# EAGLE design schematics (EAGLE 7.6.0)
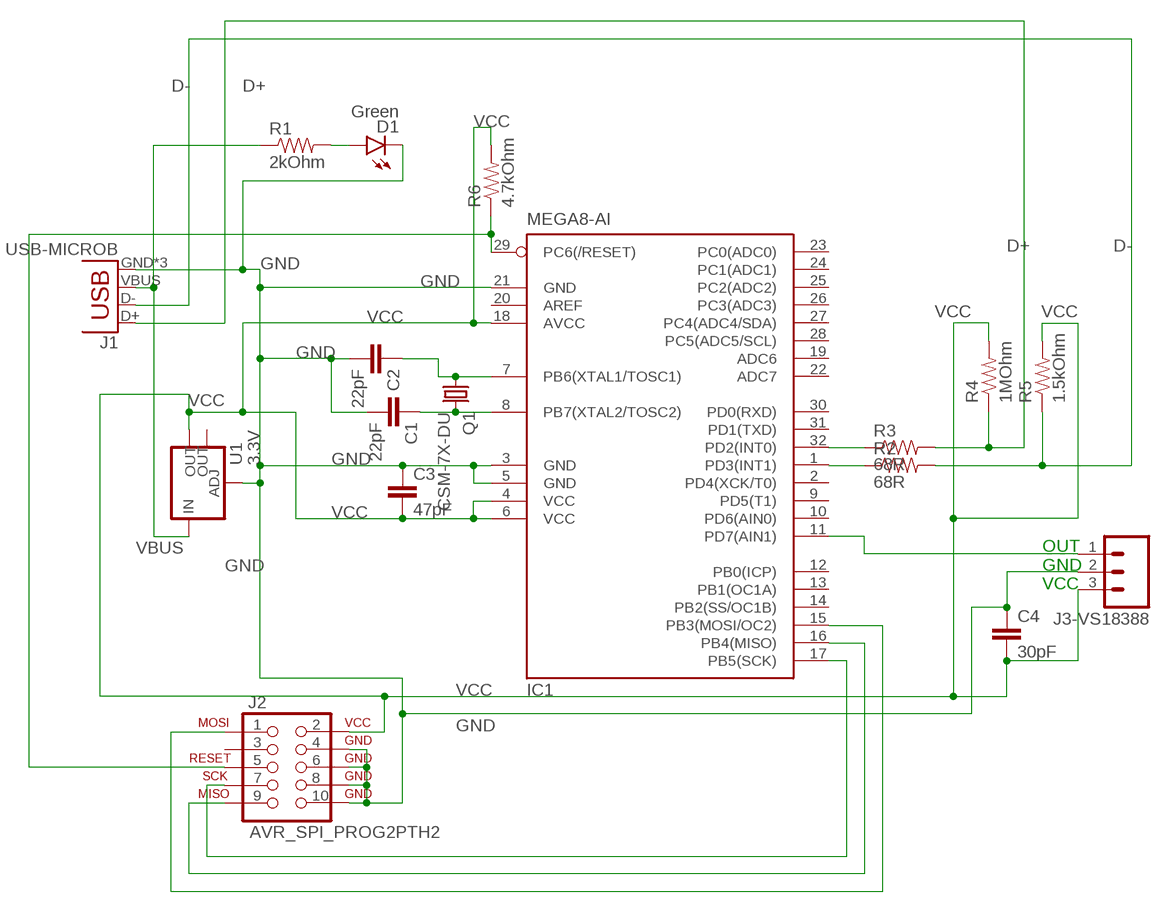
[diagram p0: schematic, sheet 1]

## Parts
C1  22pF  2.2UF-CERCAP-10009  [1206]
C2  22pF  2.2UF-CERCAP-10009  [1206]
C3  47pF  2.2UF-CERCAP-10009  [1206]
C4  30pF  2.2UF-CERCAP-10009  [1206]
D1  Green  LED1206  [LED-1206]
IC1  MEGA8-AI  [TQFP32-08]
J1  USB-MICROB  [USB-MICROB]
J2  AVR_SPI_PROG2PTH2  [2X5-SHROUDED]
J3-VS18388  M03PTH  [1X03]
Q1  CSM-7X-DU  [CSM-7X-DU]
R1  2kOhm  RESISTOR1206  [1206]
R2  68R  RESISTOR1206  [1206]
R3  68R  RESISTOR1206  [1206]
R4  1MOhm  RESISTOR1206  [1206]
R5  1.5kOhm  RESISTOR1206  [1206]
R6  4.7kOhm  RESISTOR1206  [1206]
U1  3.3V  V_REG_LM1117SOT223  [SOT223]

## Nets
D+: J1.D+ R3.2 R4.1
D-: J1.D- R2.2 R5.1
GND: C1.2 C2.2 C3.1 C4.1 D1.C IC1.3(GND) IC1.5(GND) IC1.21(GND) J1.GND J1.MT1(GND) J1.MT2(GND) J2.4(GND) J2.6(GND) J2.8(GND) J2.10(GND) J3-VS18388.2 U1.1(ADJ)
N$1: C1.1 IC1.8(PB7(XTAL2/TOSC2)) Q1.2
N$2: D1.A R1.2
N$3: C2.1 IC1.7(PB6(XTAL1/TOSC1)) Q1.1
N$6: IC1.11(PD7(AIN1)) J3-VS18388.1
N$7: IC1.16(PB4(MISO)) J2.9(MISO)
N$8: IC1.17(PB5(SCK)) J2.7(SCK)
N$9: IC1.15(PB3(MOSI/OC2)) J2.1(MOSI)
N$10: IC1.29(PC6(/RESET)) J2.5(RESET) R6.1
N$12: IC1.32(PD2(INT0)) R3.1
N$14: IC1.1(PD3(INT1)) R2.1
VBUS: J1.VBUS R1.1 U1.3(IN)
VCC: C3.2 C4.2 IC1.4(VCC) IC1.6(VCC) IC1.18(AVCC) J2.2(VCC) J3-VS18388.3 R4.2 R5.2 R6.2 U1.2(OUT)
Unconnected: IC1.2(PD4(XCK/T0)) IC1.9(PD5(T1)) IC1.10(PD6(AIN0)) IC1.12(PB0(ICP)) IC1.13(PB1(OC1A)) IC1.14(PB2(SS/OC1B)) IC1.19(ADC6) IC1.20(AREF) IC1.22(ADC7) IC1.23(PC0(ADC0)) IC1.24(PC1(ADC1)) IC1.25(PC2(ADC2)) IC1.26(PC3(ADC3)) IC1.27(PC4(ADC4/SDA)) IC1.28(PC5(ADC5/SCL)) IC1.30(PD0(RXD)) IC1.31(PD1(TXD)) J2.3(NC) U1.4(OUT)

## Notes on the sheet
- OUT
  GND
  VCC

## Library data of the parts
C1-C4 = SparkFun-Retired:2.2UF-CER: 2.2uF Ceramic SMT CAP-07888- 10V, 20% (0603) CAP-10009- 50V, 10% (1206); PROD_ID: CAP-10009; VALUE: 2.2uF
D1 = SparkFun-LED:LED: LEDs Standard schematic elements and footprints for 5mm, 3mm, 1206, and 0603 sized LEDs. 5mm - Spark Fun Electronics SKU : COM-00529 (and others)
IC1 = atmel:MEGA8: MICROCONTROLLER 8 Kbytes FLASH, 1 kbytes SRAM, 512 bytes EEPROM, USART, 6-channel 10 bit ADC, 2-channel 8 bit ADC Pin compatible with Atmega48, ATMega88, ATMega168 Source: avr.lbr; MPN: ATMEGA8-16AU; OC_FARNELL: 9171371; OC_NEWARK: 73M8863
J1 = SparkFun-Connectors:USB: USB Connectors USB-B-PTH is fully proven SKU : PRT-00139/CONN-08278 USB-miniB is fully proven SKU : PRT-00587 USB-A-PCB is untested. USB-A-H is throughly reviewed, but untested. Spark Fun Electronics SKU : PRT-00437 USB-B-SMT is throughly reviewed, but untested. Needs silkscreen touching up. USB-A-S has not been used/tested USB-MB-H has not been used/tested USB-MICROB has been used. CONN-09505; PROD_ID: CONN-09505
J2 = SparkFun-Connectors:AVR_SPI_PROG2: AVR 10-pin ICSP Header This is the standard AVR In Circuit Serial Programming header. Minimal, but includes pin one indicator. Works with standard Olimex programmers. Also look for the 6-pin reduced version. Spark Fun Electronics SKU: PRT-00778
J3-VS18388 = SparkFun-Connectors:M03: Header 3 Standard 3-pin 0.1" header. Use with straight break away headers (SKU : PRT-00116), right angle break away headers (PRT-00553), swiss pins (PRT-00743), machine pins (PRT-00117), and female headers (PRT-00115). Molex polarized connector foot print use with SKU : PRT-08232 with associated crimp pins and housings.
Q1 = crystal:CSM-7X-DU: SMD CRYSTAL Source: www.ecsxtal.com .. Crystal 3.6864MHz CSM_7X_DU.PDF; OC_FARNELL: unknown; OC_NEWARK: unknown
R1-R6 = SparkFun-Resistors:RESISTOR: Resistor Basic schematic elements and footprints for 0603, 1206, and PTH resistors.
U1 = SparkFun-PowerIC:V_REG_LM1117: Voltage Regulator LM1117 Standard adjustable voltage regulator but in SMD form. Spark Fun Electronics SKU : COM-00595; PROD_ID: VREG-08170

## Board
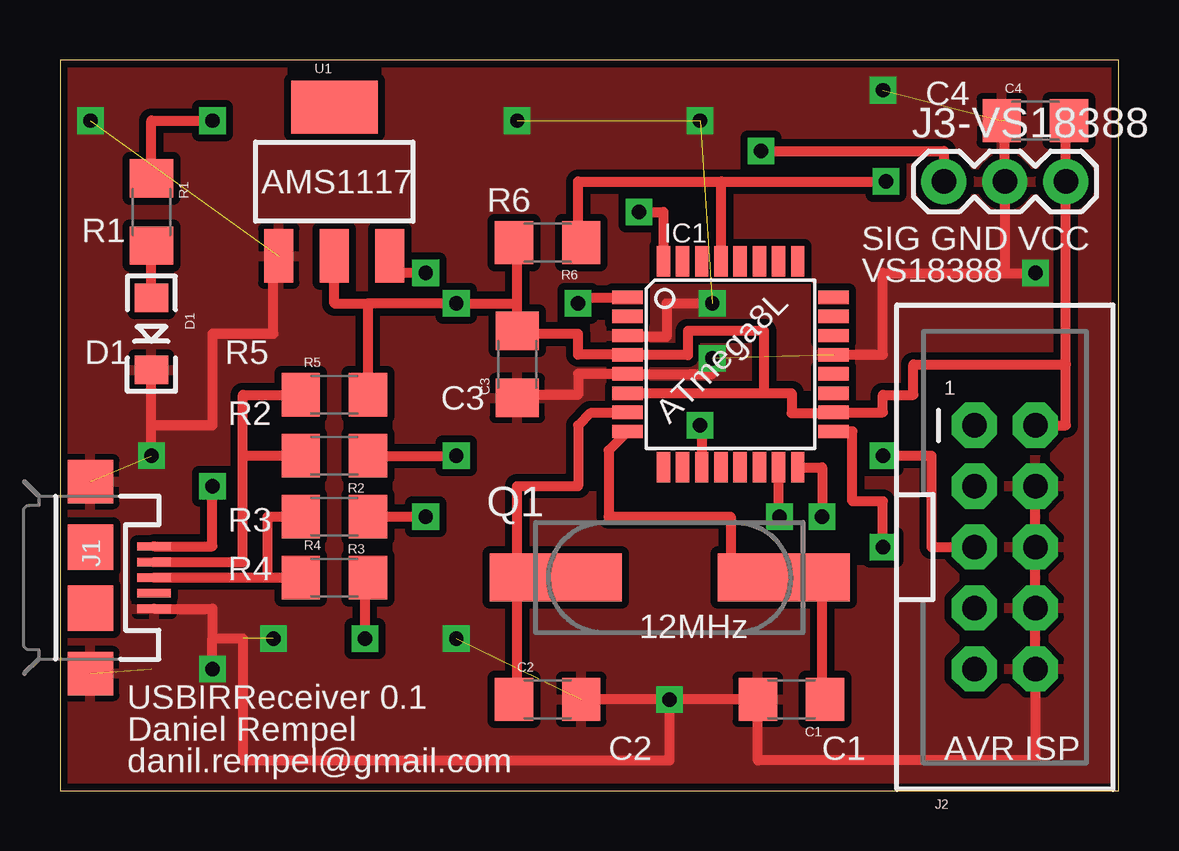
[diagram p1: board, top side]
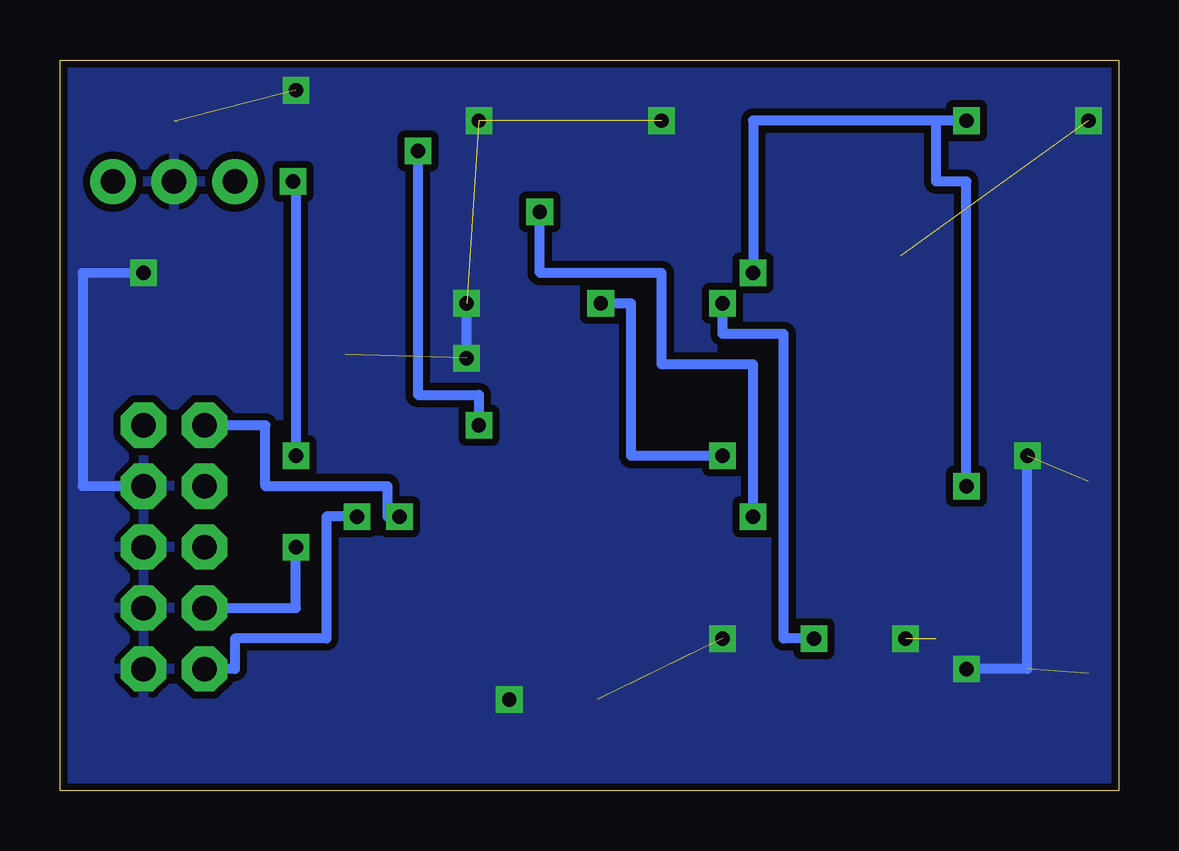
[diagram p2: board, bottom side, seen from below]

Size 44.12 x 30.47 mm. Coordinates in mm from the lower left corner, seen from the top.
Outline: 0,0 44.12,0 44.12,30.47 0,30.47 0,0
Copper layers (1*16): Top 0.035mm / dielectric 1.5mm / Bottom 0.035mm
Design rules "SparkFun": minimum track width 8mil, minimum drill 20mil, track to track 8mil, track to pad 8mil, pad to pad 8mil, via to via 8mil, smd to smd 8mil, copper to edge 8mil, drill to drill 8mil, minimum pad ring 12mil, minimum via ring 10mil, stop-mask expansion 4mil, vias tented up to drill 20mil, thermal gap 10mil

### Footprints (pad centres in the part's own frame; a part is rotated, then mirrored left to right if it is on the bottom)
1206 = smd 1.6 x 1.8: 1 -1.4,0; 2 1.4,0
LED-1206 = smd 1.2 x 1.4: A -1.5,0; C 1.5,0
TQFP32-08 = smd 1.27 x 0.559: 1 -4.293,2.8; 2 -4.293,2; 3 -4.293,1.2; 4 -4.293,0.4; 5 -4.293,-0.4; 6 -4.293,-1.2; 7 -4.293,-2; 8 -4.293,-2.8; 17 4.293,-2.8; 18 4.293,-2; 19 4.293,-1.2; 20 4.293,-0.4; 21 4.293,0.4; 22 4.293,1.2; 23 4.293,2; 24 4.293,2.8 | smd 0.559 x 1.27: 9 -2.8,-4.293; 10 -2,-4.293; 11 -1.2,-4.293; 12 -0.4,-4.293; 13 0.4,-4.293; 14 1.2,-4.293; 15 2,-4.293; 16 2.8,-4.293; 25 2.8,4.293; 26 2,4.293; 27 1.2,4.293; 28 0.4,4.293; 29 -0.4,4.293; 30 -1.2,4.293; 31 -2,4.293; 32 -2.8,4.293
USB-MICROB = smd 0.35 x 1.4: D+ 0,2.65; D- -0.65,2.65; GND 1.3,2.65; ID 0.65,2.65; VBUS -1.3,2.65 | smd 1.8 x 1.9: MT1 -4,0; MT2 4,0 | smd 1.9 x 1.9: P$1 -1.27,0; P$2 1.27,0
2X5-SHROUDED = drill 1.016 pad 1.88 octagon: 1 -1.27,5.08; 2 1.27,5.08; 3 -1.27,2.54; 4 1.27,2.54; 5 -1.27,0; 6 1.27,0; 7 -1.27,-2.54; 8 1.27,-2.54; 9 -1.27,-5.08; 10 1.27,-5.08
1X03 = drill 1.016 pad 1.88: 1 0,0; 2 2.54,0; 3 5.08,0
CSM-7X-DU = smd 5.5 x 2: 1 -4.75,0; 2 4.75,0
SOT223 = smd 1.219 x 2.235: 1 -2.311,-3.099; 2 0,-3.099; 3 2.311,-3.099 | smd 3.6 x 2.2: 4 0,3.099

### Placement (x,y rotation side)
C1  30.48,3.81 180 top
C2  20.32,3.81 0 top
C3  19.05,17.78 90 top
C4  40.64,27.94 0 top
D1  3.81,19.05 270 top
IC1  27.94,17.78 0 top
J1  1.27,8.89 270 top
J2  39.37,10.16 0 top
J3-VS18388  36.83,25.4 0 top
Q1  25.4,8.89 0 top
R1  3.81,24.13 270 top
R2  11.43,13.97 180 top
R3  11.43,11.43 180 top
R4  11.43,8.89 0 top
R5  11.43,16.51 0 top
R6  20.32,22.86 180 top
U1  11.43,25.4 0 top

### Tracks (layer width: path | path; a pad name or v marks a point on that pad's centre or on a via)
D+
  Top 0.406: J1.D+ 8.64,8.89 | 8.64,8.89 R4.1 | R3.2 8.64,11.43 8.64,8.89
D-
  Top 0.406: J1.D- 7.62,9.54 7.62,13.97 | R2.2 7.62,13.97 | 7.62,13.97 7.62,16.51 R5.1
GND  (via drill 0.6)  (10 unrouted)
  Top 0.406: v3.81,13.97 3.81,15.24 | 3.81,15.24 D1.C | 3.81,15.24 6.35,15.24 6.35,19.05 8.89,19.05 8.89,21.59 9.12,21.59 U1.1 | C3.1 19.05,16.51 21.59,16.51 21.59,17.38 IC1.5 27.18,17.38 v27.18,18.03 | 39.37,27.94 J3-VS18388.2 39.37,21.59 | J2.4 J2.6 J2.8 J2.10 40.64,1.27 29.08,1.27 C1.2 v25.4,3.81 | v6.35,5.08 6.35,6.35 | 6.35,6.35 7.62,6.35 7.62,1.27 25.4,1.27 v25.4,3.81 | IC1.21 34.29,18.18 34.29,21.59 39.37,21.59 | 39.37,21.59 v40.64,21.59 | v27.18,20.32 25.27,20.32 25.27,18.92 23.65,18.92 IC1.3 | v25.4,3.81 C2.2 | J1.GND 6.35,7.59 6.35,6.35
  Bottom 0.406: v3.81,13.97 3.81,5.08 v6.35,5.08 | v40.64,21.59 43.18,21.59 43.18,12.7 J2.4 | v27.18,18.03 v27.18,20.32
  other vias: 1.27,27.94 8.89,6.35 16.51,6.35 19.05,27.94 26.67,27.94 34.29,29.21
  pour Top (isolate 0.305): 0,30.48 44.2,30.48 44.2,0 0,0
  pour Bottom (isolate 0.305): 0,30.48 44.2,30.48 44.2,0 0,0
N$1
  Top 0.406: 30.48,8.89 Q1.2 | C1.1 31.75,3.81 31.75,8.89 Q1.2 | 23.5,14.98 IC1.8 22.86,14.19 22.86,11.43 27.94,11.43 27.94,8.89 Q1.2
N$2
  Top 0.406: D1.A R1.2
N$3
  Top 0.406: C2.1 19.05,3.81 19.05,8.89 | 19.05,8.89 19.05,12.7 21.59,12.7 21.59,15.24 22.1,15.75 23.65,15.75 IC1.7 | 21.59,8.89 Q1.1 19.05,8.89
N$6  (via drill 0.6)
  Top 0.406: v26.67,15.24 26.74,15.24 IC1.11 | v29.21,26.67 36.83,26.67 J3-VS18388.1
  Bottom 0.406: v29.21,26.67 29.21,16.51 26.67,16.51 v26.67,15.24
N$7  (via drill 0.6)
  Top 0.406: IC1.16 31.75,13.49 v31.75,11.43
  Bottom 0.406: v31.75,11.43 33.02,11.43 33.02,6.35 36.83,6.35 36.83,5.08 J2.9
N$8  (via drill 0.6)
  Top 0.406: v34.29,10.16 34.29,12.06 33.02,12.06 33.02,14.99 IC1.17
  Bottom 0.406: J2.7 34.29,7.62 v34.29,10.16
N$9  (via drill 0.6)
  Top 0.406: 29.97,13.49 IC1.15 29.94,11.43 v29.97,11.43
  Bottom 0.406: J2.1 35.56,15.24 35.56,12.7 30.48,12.7 30.48,11.43 v29.97,11.43
N$10  (via drill 0.6)
  Top 0.406: R6.1 21.59,22.86 21.59,25.4 27.56,25.4 | IC1.29 27.56,22.07 27.56,25.4 | 27.56,25.4 v34.42,25.4 | J2.5 36.32,10.16 36.32,13.97 v34.29,13.97
  Bottom 0.406: v34.42,25.4 34.29,25.4 v34.29,13.97
N$12  (via drill 0.6)
  Top 0.406: R3.1 v15.24,11.43 | v24.13,24.13 25.14,24.13 IC1.32
  Bottom 0.406: v15.24,11.43 15.24,17.78 19.05,17.78 19.05,21.59 24.13,21.59 v24.13,24.13
N$14  (via drill 0.6)
  Top 0.406: R2.1 v16.51,13.97 | v21.59,20.32 21.59,20.57 IC1.1
  Bottom 0.406: v16.51,13.97 20.32,13.97 20.32,20.32 v21.59,20.32
VBUS  (via drill 0.6)
  Top 0.406: R1.1 3.81,27.94 v6.35,27.94 | v15.24,21.59 13.74,21.59 U1.3 | J1.VBUS 6.35,10.19 v6.35,12.7
  Bottom 0.406: v6.35,27.94 7.62,27.94 | 7.62,27.94 15.24,27.94 v15.24,21.59 | v6.35,12.7 6.35,25.4 7.62,25.4 7.62,27.94
VCC  (via drill 0.6)
  Top 0.406: 19.05,20.32 C3.2 19.05,19.05 21.59,19.05 21.59,18.18 IC1.4 23.65,18.16 26.16,18.16 26.16,19.18 29.34,19.18 29.34,16.58 | 19.05,20.32 19.05,22.86 R6.2 | J2.2 41.91,15.24 41.91,17.78 | 41.91,17.78 J3-VS18388.3 41.91,27.94 C4.2 | 19.05,20.32 v16.51,20.32 12.83,20.32 | IC1.6 29.34,16.58 | 29.34,16.58 30.48,16.58 30.48,15.75 32.23,15.75 IC1.18 34.29,15.78 34.29,16.51 35.56,16.51 35.56,17.78 41.91,17.78 | 12.7,16.51 R5.2 12.83,20.32 | U1.2 11.43,20.32 12.83,20.32 | R4.2 12.7,8.89 v12.7,6.35
  Bottom 0.406: v12.7,6.35 13.97,6.35 13.97,19.05 16.51,19.05 v16.51,20.32

### Text on the board
tPlace: C4 | AMS1117 | R6 | R1 | SIG GND VCC / VS18388 | D1 | R5 | 1 | C3 | R2 | ATmega8L | R3 | R4 | 12MHz | USBIRReceiver 0.1 / Daniel Rempel / danil.rempel@gmail.com | C2 | C1 | AVR ISP